# EAGLE schematic sos_v1 (EAGLE 9.6.2)
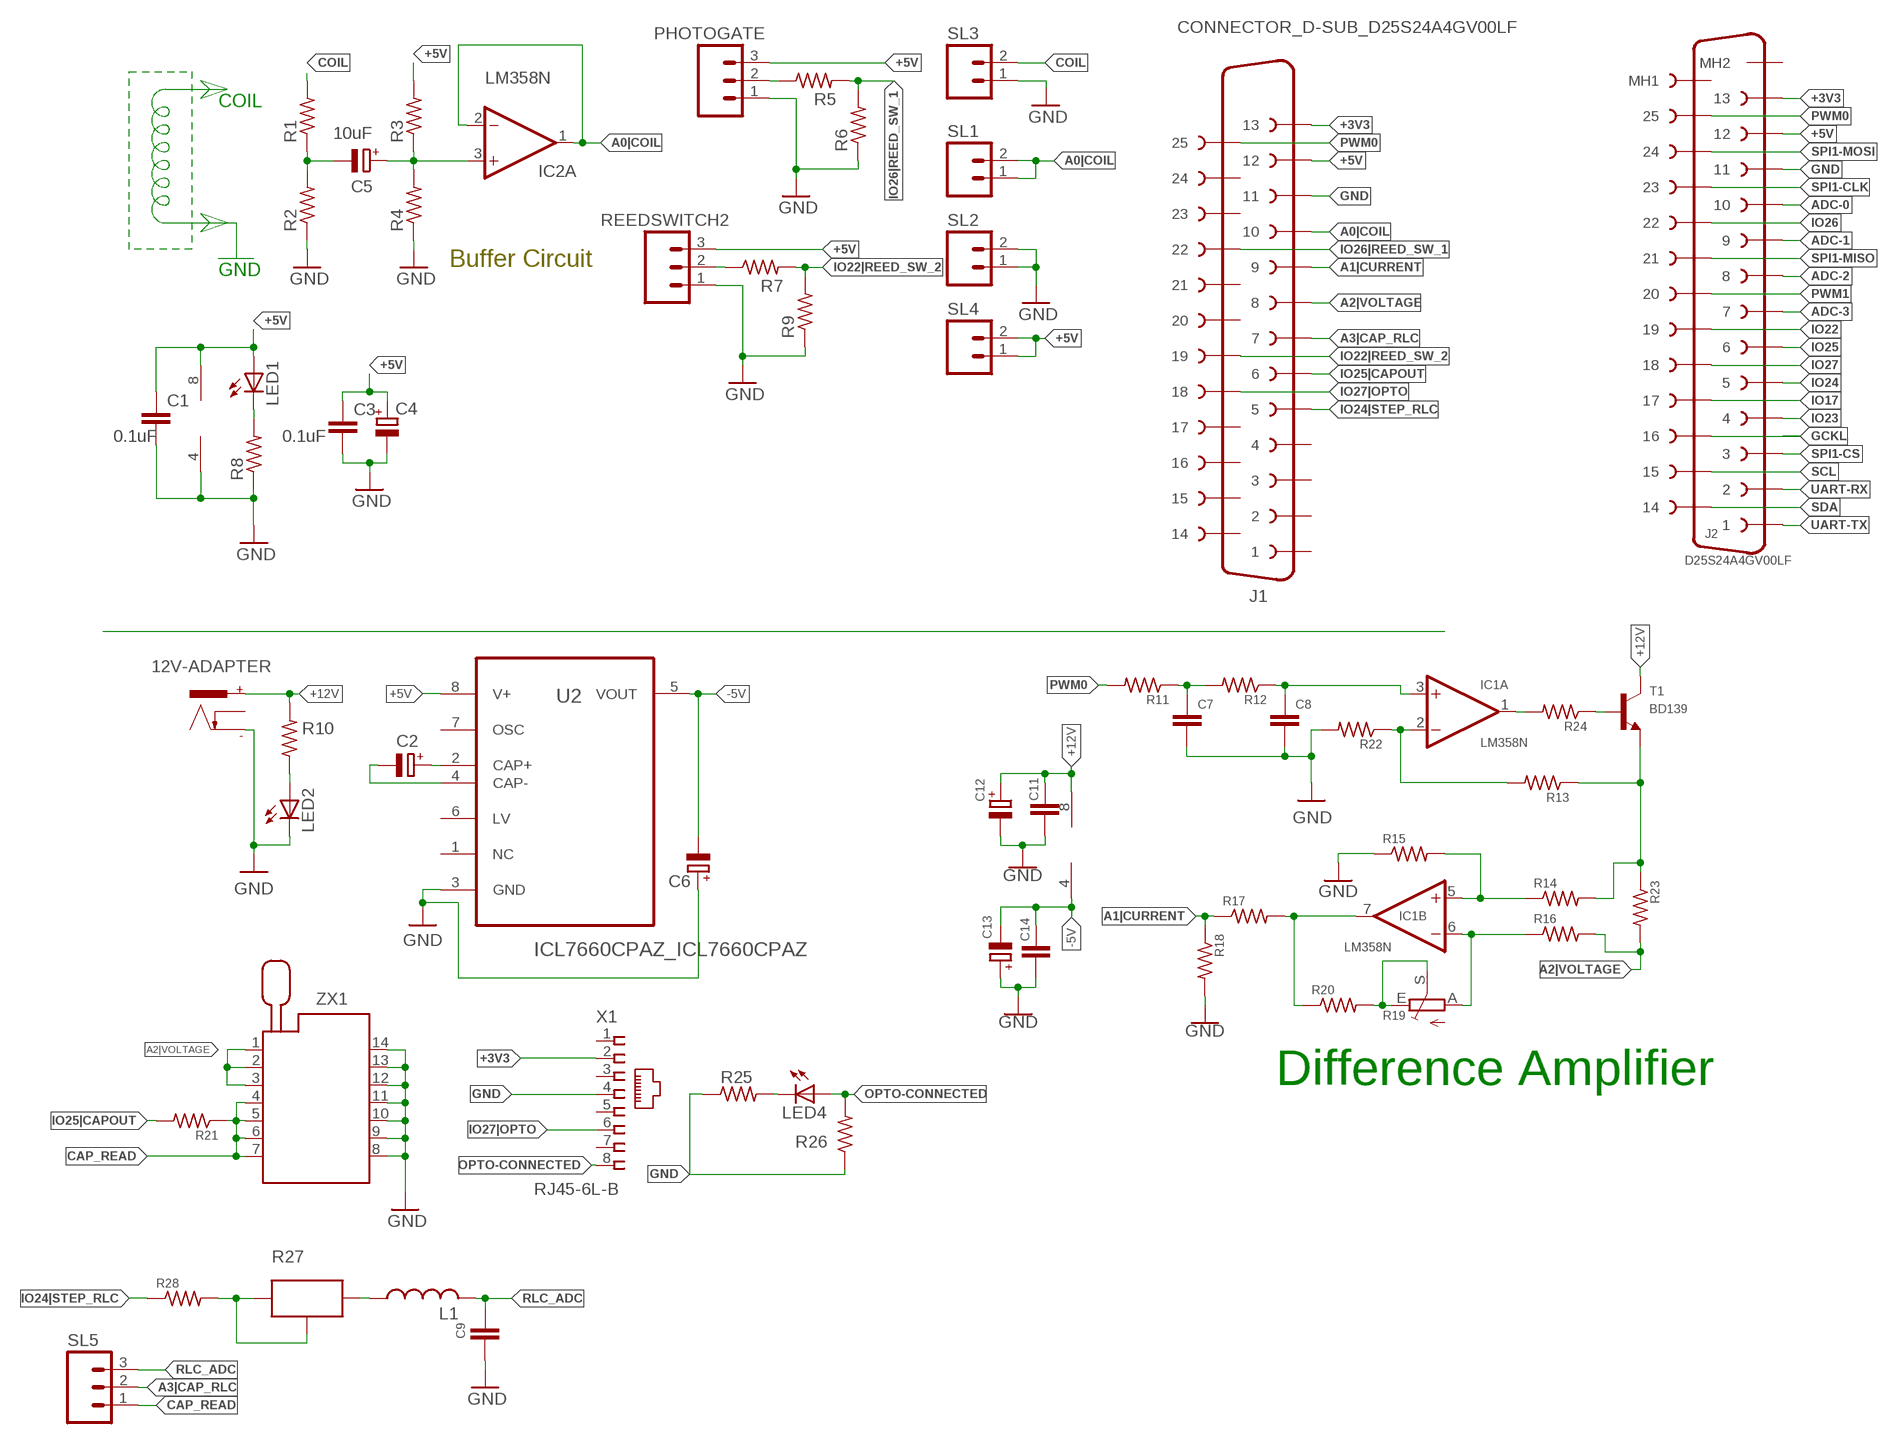
[diagram p0: schematic, sheet 1]

## Parts
12V-ADAPTER  POWER_CON  [NEB21R]
C1  0.1uF  C-EU025-025X050  [C025-025X050]
C2  CPOL-EUTT2D5  [TT2D5]
C3  0.1uF  C-EU025-025X050  [C025-025X050]
C4  CPOL-EUE2.5-6  [E2,5-6]
C5  10uF  CPOL-EUE2.5-6  [E2,5-6]
C6  CPOL-EUTT2D5  [TT2D5]
C7  C-EU025-025X050  [C025-025X050]
C8  C-EU025-025X050  [C025-025X050]
C9  C-EU025-025X050  [C025-025X050]
C11  C-EU025-025X050  [C025-025X050]
C12  CPOL-EUTT2D5  [TT2D5]
C13  CPOL-EUTT2D5  [TT2D5]
C14  C-EU025-025X050  [C025-025X050]
IC1  LM358N  [DIL08]
IC2  LM358N  [DIL08]
J1  CONNECTOR_D-SUB_D25S24A4GV00LF  [CONNECTOR_D-SUB_D25S24A4GV00LF]
J2  D25S24A4GV00LF  [D25S24A4GV00LF]
L1  L-USTJ3-U2  [TJ3-U2]
LED1  LED3MM  [LED3MM]
LED2  LED3MM  [LED3MM]
LED4  LED3MM  [LED3MM]
PHOTOGATE  M03  [03P]
R1  R-US_0204/7  [0204/7]
R2  R-US_0204/7  [0204/7]
R3  R-US_0204/7  [0204/7]
R4  R-US_0204/7  [0204/7]
R5  R-US_0204/7  [0204/7]
R6  R-US_0204/7  [0204/7]
R7  R-US_0204/7  [0204/7]
R8  R-US_0204/7  [0204/7]
R9  R-US_0204/7  [0204/7]
R10  R-US_0204/7  [0204/7]
R11  R-US_0204/7  [0204/7]
R12  R-US_0204/7  [0204/7]
R13  R-US_0204/7  [0204/7]
R14  R-US_0204/7  [0204/7]
R15  R-US_0204/7  [0204/7]
R16  R-US_0204/7  [0204/7]
R17  R-US_0204/7  [0204/7]
R18  R-US_0204/7  [0204/7]
R19  TRIM_EU-RJ9W  [RJ9W]
R20  R-US_0204/7  [0204/7]
R21  R-US_0204/7  [0204/7]
R22  R-US_0204/7  [0204/7]
R23  R-US_0207/10  [0207/10]
R24  R-US_0204/7  [0204/7]
R25  R-US_0204/7  [0204/7]
R26  R-US_0204/7  [0204/7]
R27  POTNORMAL  [RJ9W]
R28  R-US_0207/10  [0207/10]
REEDSWITCH2  M03  [03P]
SL1  M02  [02P]
SL2  M02  [02P]
SL3  M02  [02P]
SL4  M02  [02P]
SL5  M03  [03P]
T1  BD139  [TO126]
U2  ICL7660CPAZ_ICL7660CPAZ  [ICL7660CPAZ_DIP254P762X533-8]
X1  RJ45-6L-B  [RJ45-NO-SHIELD]
ZX1  214-3339-00-0602J  [214-3339-00-0602J]

## Nets
+3V3: J1.P$13 J2.13 X1.2
+5V: C1.1 C3.1 C4.+ IC2.8(P:V+) J1.P$14 J2.12 LED1.A PHOTOGATE.3 R3.2 REEDSWITCH2.3 SL4.1 SL4.2 U2.8(V+)
+12V: 12V-ADAPTER.+ C11.1 C12.+ IC1.8(P:V+) R10.2 T1.2(C)
-5V: C6.- C13.- C14.1 IC1.4(P:V-) U2.5(VOUT)
A0|COIL: IC2.1(A:OUT) IC2.2(A:-IN) J1.P$16 SL1.1 SL1.2
A1|CURRENT: J1.P$17 R17.1 R18.1
A2|VOLTAGE: J1.P$18 R16.2 R23.2 ZX1.1 ZX1.2 ZX1.3
A3|CAP_RLC: J1.P$19 SL5.2
ADC-0: J2.10
ADC-1: J2.9
ADC-2: J2.8
ADC-3: J2.7
CAP_READ: R21.1 SL5.1 ZX1.4 ZX1.5 ZX1.6 ZX1.7
CLAMP_SIGNAL: C5.+ IC2.3(A:+IN) R3.1 R4.2
COIL: R1.2 SL3.2
GCKL: J2.16
GND: 12V-ADAPTER.- C1.2 C3.2 C4.- C6.+ C7.2 C8.2 C9.2 C11.2 C12.- C13.+ C14.2 IC2.4(P:V-) J1.P$15 J2.11 LED2.K(C) PHOTOGATE.1 R2.1 R4.1 R6.1 R8.1 R9.1 R15.1 R18.2 R22.2 R25.1 R26.1 REEDSWITCH2.1 SL2.1 SL2.2 SL3.1 U2.3(GND) X1.4 ZX1.8 ZX1.9 ZX1.10 ZX1.11 ZX1.12 ZX1.13 ZX1.14
IO17: J2.17
IO22: J2.19
IO22|REED_SW_2: J1.P$7 R7.2 R9.2
IO23: J2.4
IO24: J2.5
IO24|STEP_RLC: J1.P$21 R28.1
IO25: J2.6
IO25|CAPOUT: J1.P$20 R21.2
IO26: J2.22
IO26|REED_SW_1: J1.P$4 R5.2 R6.2
IO27: J2.18
IO27|OPTO: J1.P$8 X1.6
N$1: C5.- R1.1 R2.2
N$2: PHOTOGATE.2 R5.1
N$3: R7.1 REEDSWITCH2.2
N$5: LED1.K(C) R8.2
N$9: C2.+ U2.2(CAP+)
N$10: C2.- U2.4(CAP-)
N$11: C7.1 R11.1 R12.2
N$12: LED2.A R10.1
N$13: IC1.1(A:OUT) R24.2
N$14: R24.1 T1.3(B)
N$15: C8.1 IC1.3(A:+IN) R12.1
N$16: IC1.2(A:-IN) R13.2 R22.1
N$17: IC1.5(B:+IN) R14.1 R15.2
N$18: IC1.6(B:-IN) R16.1 R19.A
N$19: R13.1 R14.2 R23.1 T1.1(E)
N$20: R19.E R19.S R20.2
N$21: IC1.7(B:OUT) R17.2 R20.1
N$22: LED4.K(C) R25.2
N$24: R27.E R27.S R28.2
N$25: L1.1 R27.A
OPTO-CONNECTED: LED4.A R26.2 X1.8
PWM0: J1.P$1 J2.25 R11.2
PWM1: J2.20
RLC_ADC: C9.1 L1.2 SL5.3
SCL: J2.15
SDA: J2.14
SPI1-CLK: J2.23
SPI1-CS: J2.3
SPI1-MISO: J2.21
SPI1-MOSI: J2.24
UART-RX: J2.2
UART-TX: J2.1
Unconnected: 12V-ADAPTER.C IC2.5(B:+IN) IC2.6(B:-IN) IC2.7(B:OUT) J1.1 J1.P$2 J1.P$3 J1.P$5 J1.P$6 J1.P$9 J1.P$10 J1.P$11 J1.P$12 J1.P$22 J1.P$23 J1.P$24 J2.MH1 J2.MH2 U2.1(NC) U2.6(LV) U2.7(OSC) X1.1 X1.3 X1.5 X1.7

## Notes on the sheet
- COIL
- Buffer Circuit
- GND
- Difference Amplifier

## Library data of the parts
12V-ADAPTER = CEDT_JANUARY_2015_v5:POWER_CON: DC Power Connector
C1 C3 = Arduino_Hackathon_v5:C-EU: CAPACITOR, European symbol
C2 C4-C6 C12 C13 = rcl:CPOL-EU: POLARIZED CAPACITOR, European symbol; SPICEPREFIX: C
C7-C9 C11 C14 = rcl:C-EU: CAPACITOR, European symbol; SPICEPREFIX: C
IC1 IC2 = CEDT_JANUARY_2015_v5:LM358: OP AMP also LM158; LM258; LM2904 Source: http://cache.national.com/ds/LM/LM158.pdf
J1 = d25-female:CONNECTOR_D-SUB_D25S24A4GV00LF: D-SUB, 25POS, RCPT, VERT SLDR Datasheet <https://cdn.amphenol-icc.com/media/wysiwyg/files/documentation/datasheet/inputoutput/io_dsub_d8656.pdf> Drawing <https://cdn.amphenol-icc.com/media/wysiwyg/files/drawing/c01-8646-0815.pdf>; CATEGORY: Connector; DESCRIPTION: 25 Position D-Sub Receptacle, Female Sockets Connector; GENDER: Female; MANUFACTURER: amphenol-icc; MPN: D25S24A4GV00LF; OPERATING_TEMP: -55°C to +125°C; PART_STATUS: Active; ROHS_COMPLIANT: EU RoHS With Exemption 6c; SERIES: DELTA D; SUB-CATEGORY: D-SUB; TYPE: Vertical
J2 = Connector_D-Sub:D25S24A4GV00LF: D-SUB, 25POS, RCPT, VERT SLDR Datasheet <https://cdn.amphenol-icc.com/media/wysiwyg/files/documentation/datasheet/inputoutput/io_dsub_d8656.pdf> Drawing <https://cdn.amphenol-icc.com/media/wysiwyg/files/drawing/c01-8646-0815.pdf>; CATEGORY: Connector; DESCRIPTION: 25 Position D-Sub Receptacle, Female Sockets Connector; GENDER: Female; MANUFACTURER: amphenol-icc; MPN: D25S24A4GV00LF; OPERATING_TEMP: -55°C to +125°C; PART_STATUS: Active; ROHS_COMPLIANT: EU RoHS With Exemption 6c; SERIES: DELTA D; SUB-CATEGORY: D-SUB; TYPE: Vertical
L1 = rcl:L-US: INDUCTOR, American symbol; SPICEPREFIX: L
LED1 LED2 LED4 = CEDT_JANUARY_2015_v5:LED
PHOTOGATE REEDSWITCH2 SL5 = con-amp-quick:M03: AMP QUICK CONNECTOR; OC_FARNELL: unknown; OC_NEWARK: unknown
R1-R18 R20-R26 R28 = rcl:R-US_: RESISTOR, American symbol; SPICEPREFIX: R
R19 = pot:TRIM_EU-: POTENTIOMETER
R27 = CEDT_JANUARY_2015_v5:POT
SL1-SL4 = con-amp-quick:M02: AMP QUICK CONNECTOR; OC_FARNELL: unknown; OC_NEWARK: unknown
T1 = transistor:BD139: NPN TRANSISTOR
U2 = CurveTracer_V6:ICL7660CPAZ_ICL7660CPAZ: CMOS Voltage Converters Check prices <https://pricing.snapeda.com/parts/ICL7660CPAZ/Renesas%20Electronics/view-part?ref=eda>; AVAILABILITY: In Stock; DESCRIPTION: Charge Pump Switching Regulator IC Positive or Negative Fixed -Vin, 2Vin 1 Output 45mA 8-DIP (0.300, 7.62mm); MF: Renesas Electronics; MP: ICL7660CPAZ; PACKAGE: DIP-8 Intersil; PRICE: None
X1 = con-tycoelectronics:RJ45: CORCOM Modular RJ Jacks No Shield Source: www.tycoelectronics.com .. ENG_DS_1654001_1099_RJ_L_0507.pdf; MPN: RJ45-6L-B; OC_FARNELL: unknown; OC_NEWARK: 16R6090
ZX1 = con-3m:214-3339-00-0602J: Zero Insertion Force Socked Source: http://www.3M.com/ehpd; MF: 3M; MPN: 214-3339-00-0602J; OC_FARNELL: 1247151; OC_NEWARK: 85K7793

## Net classes
0 default: width 0.508 mm
1 POWER: width 0.61 mm, drill 0.7 mm, clearance 0.25 mm